# EasyEDA Pro project ProPrj_Sandro OrangePi CM5 Carrier Board_2024-09-12.epro, board PCB
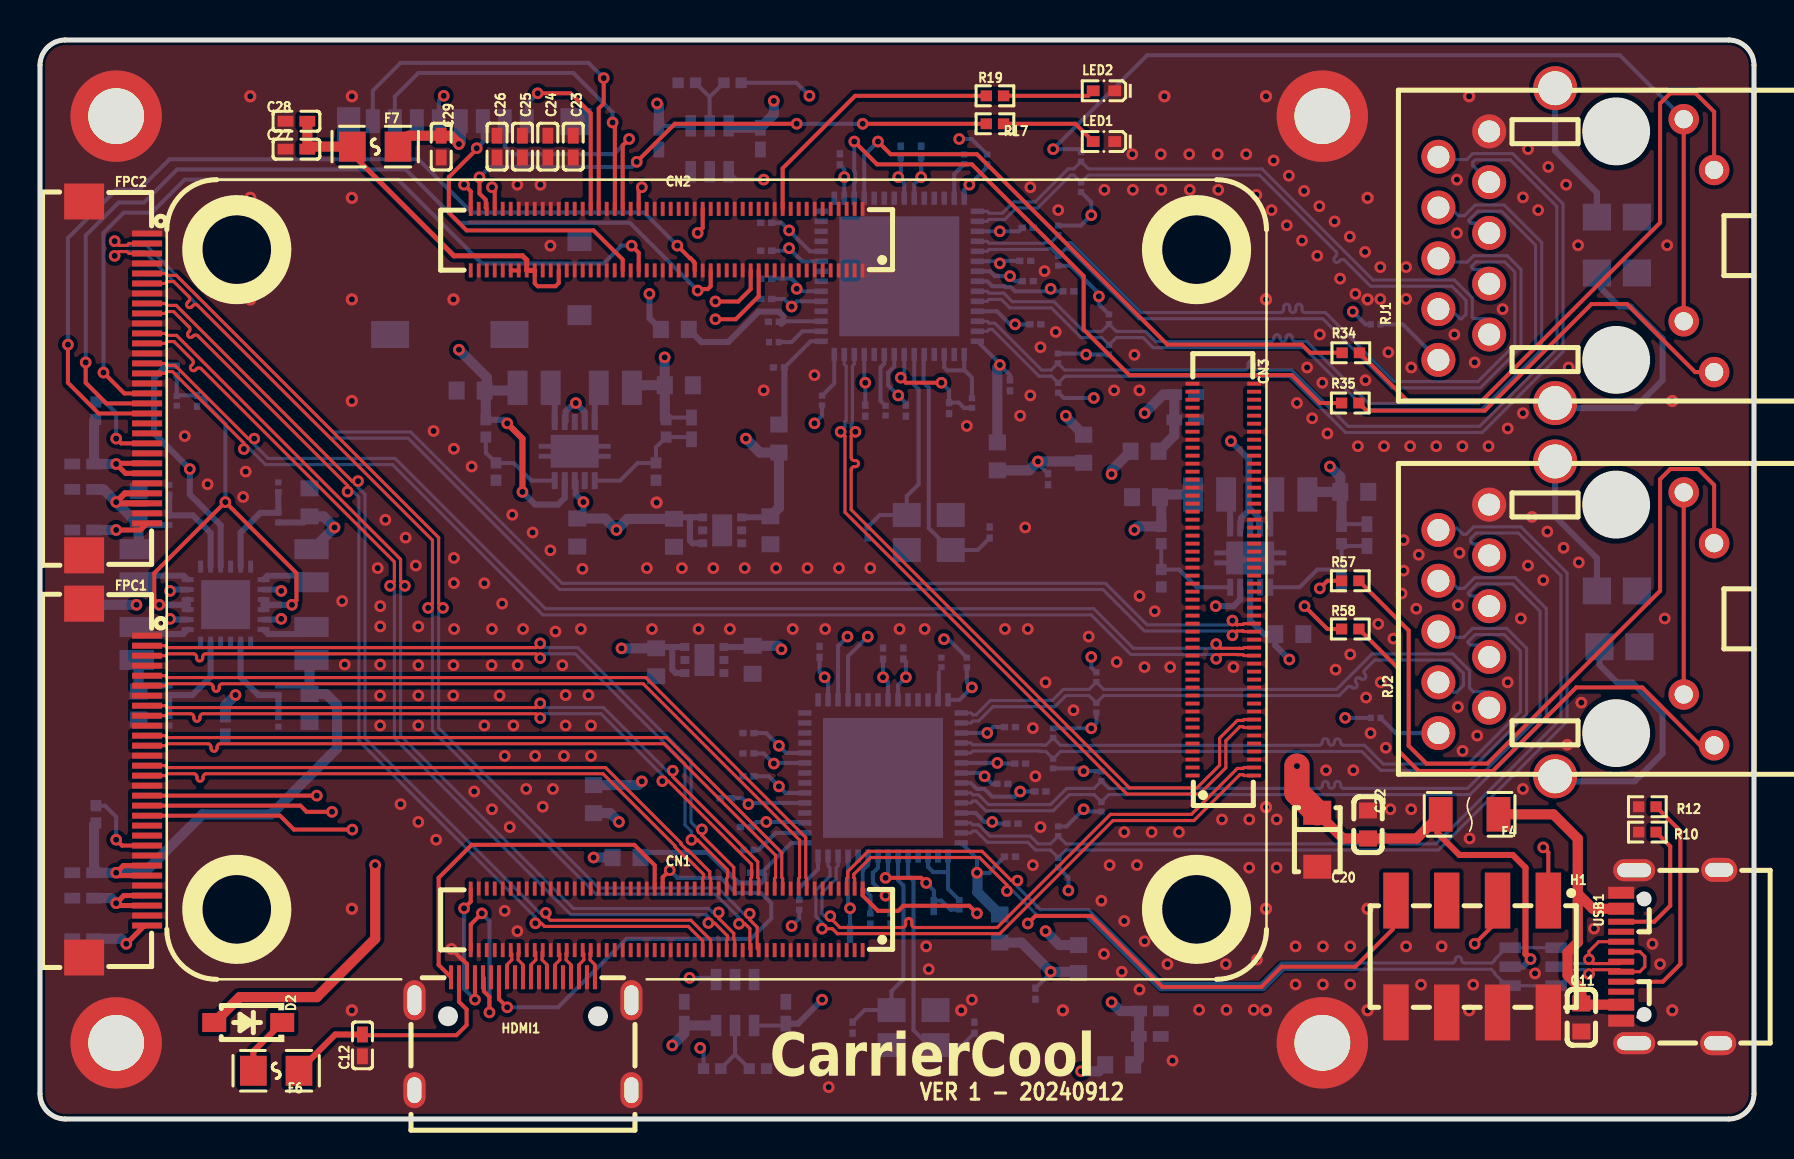
[diagram p2: board, top side]
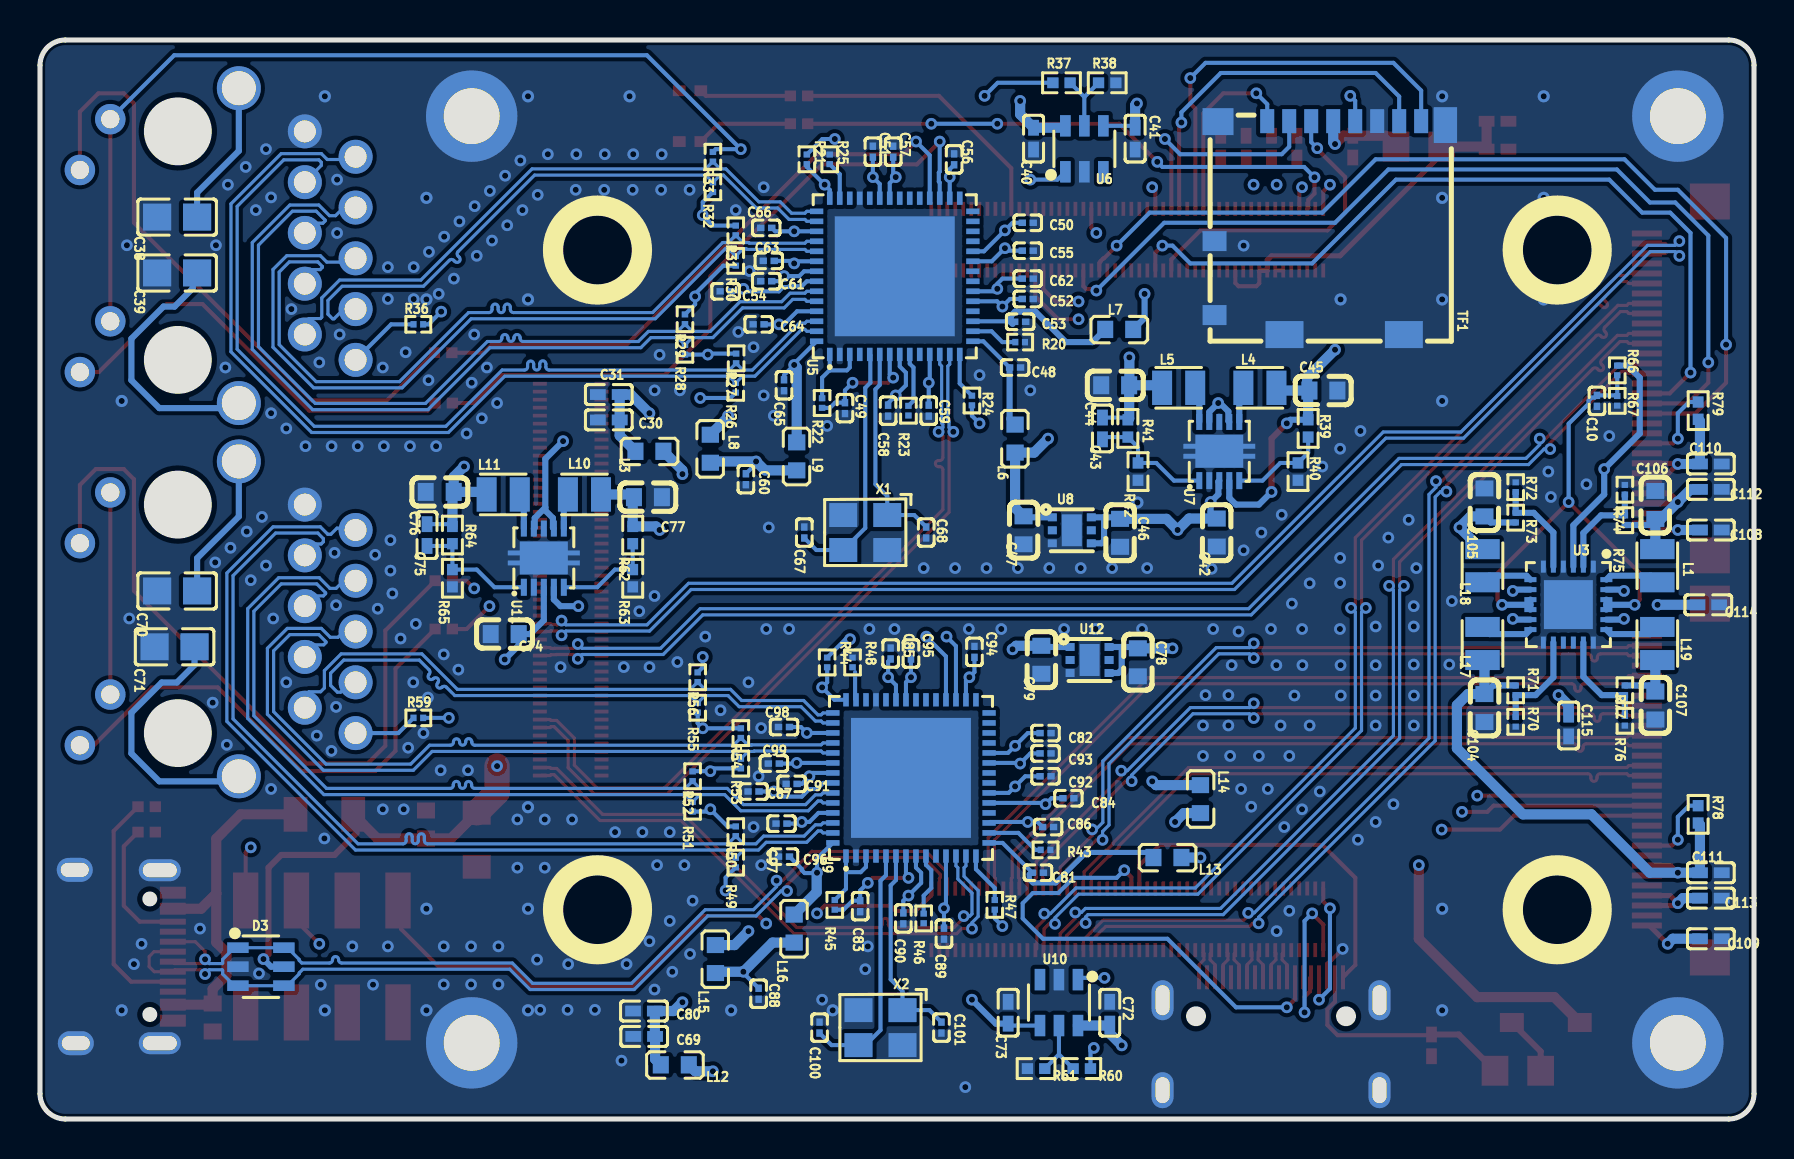
[diagram p3: board, bottom side, seen from below]

Outline 85.72 x 53.97 mm; copper layers: Top Layer, Inner1, Inner2, Bottom Layer. Coordinates in mm from the lower left corner of the outline.
Outline path: 0,52.7 0,1.27 arc(0.37,0.37) 1.27,0 84.46,0 arc(85.35,0.37) 85.72,1.27 85.72,52.7 arc(85.35,53.6) 84.46,53.97 1.27,53.97 arc(0.37,53.6) 0,52.7
Stack: Top Layer 0.035mm Outer layer copper thickness 1oz / Dielectric1 0.2104mm 7628 RC49% 8.6mil / Inner1 0.0152mm Inner layer copper thickness / Dielectric2 1.065mm 1.1mm H/HOZ Copper / Inner2 0.0152mm Inner layer copper thickness / Dielectric3 0.2104mm 7628 RC49% 8.6mil / Bottom Layer 0.035mm Outer layer copper thickness 1oz

## Design rules (mm)
net USB_N: DP1
net USB_P: DP1
net HDMI0_TX2_P: DP2
net HDMI0_TX1_P: DP3
net HDMI0_TX1_N: DP3
net HDMI0_TX0_P: DP4
net HDMI0_TX0_N: DP4
net HDMI0_CLK_P: DP5
net HDMI0_CLK_N: DP5
net HDMI0_TX2_N: DP2
net CSI0_D0N: DP16
net CSI0_D0P: DP16
net CSI0_D1N: DP14
net CSI0_D1P: DP14
net CSI0_CKN: DP15
net CSI0_CKP: DP15
net CSI0_D2N: DP20
net CSI0_D2P: DP20
net CSI0_D3N: DP13
net CSI0_D3P: DP13
net CSI1_CKP: DP19
net CSI1_CKN: DP19
net CSI1_D1P: DP18
net CSI1_D1N: DP18
net CSI1_D0P: DP17
net CSI1_D0N: DP17
net CSI1_D3N: DP21
net CSI1_D3P: DP21
net ETH0_TR3_P: DP6
net ETH0_TR3_N: DP6
net ETH0_TR2_P: DP8
net ETH0_TR2_N: DP8
net ETH0_TR1_P: DP7
net ETH0_TR1_N: DP7
net ETH0_TR0_P: DP9
net ETH0_TR0_N: DP9
net ETH1_TR3_P: ETH1_TR3
net ETH1_TR3_N: ETH1_TR3
net ETH1_TR2_P: DP12
net ETH1_TR2_N: DP12
net ETH1_TR1_P: DP11
net ETH1_TR1_N: DP11
net ETH1_TR0_P: DP10
net ETH1_TR0_N: DP10
net ETH0_USB_M: DP24
net ETH0_USB_P: DP24
net ETH1_USB_M: DP23
net ETH1_USB_P: DP23
net CSI1_D2P: DP22
net CSI1_D2N: DP22
template: Custom Config
spacing copperThickness1oz (default): track to track 0.102, other pairs 0.076 to 0.3
spacing copperThickness2oz: track to track 0.203, other pairs 0.152 to 0.3
spacing copperThicknessInner0.5oz: track to track 0.089, other pairs 0.152 to 0.3
track width copperThickness1oz (default): min 0.102, default 0.254, max 2.54
track width copperThickness0.5oz: min 0.089, default 0.254, max 2.54
track width copperThickness2oz: min 0.203, default 0.254, max 2.54
differential pair differentialPair (default): width min 0.127, default 0.157, max 0.157; gap min 0.152, default 0.152
via viaSize (default): diameter min 0.3, default 0.61, max 10; hole min 0.201, default 0.305, max 6.299

## Placement (name value [footprint] x y rotation side)
C10  100nF  [C0201]  7.86 35.92 270 bottom
C11  2.2uF  [C0603]  77.09 5.08 270 top
C12  100nF  [C0402]  16.13 3.68 270 top
C20  22uF  [CAP-SMD_L3.2-W1.6]  63.88 13.97 270 top
C22  100nF  [C0603]  66.42 14.73 90 top
C23  100nF  [C0402]  26.67 48.64 90 top
C24  100nF  [C0402]  25.4 48.64 90 top
C25  100nF  [C0402]  24.13 48.64 90 top
C26  100nF  [C0402]  22.86 48.64 90 top
C27  100nF  [C0402]  12.83 48.51 180 top
C28  100nF  [C0402]  12.83 49.91 180 top
C29  100nF  [C0402]  20.07 48.64 270 top
C30  100nF  [C0402]  57.28 34.97 180 bottom
C31  10nF  [C0402]  57.28 36.24 180 bottom
C38  100nF  [C0805]  78.87 45.11 0 bottom
C39  100nF  [C0805]  78.87 42.32 180 bottom
C40  100nF  [C0402]  36.03 49.04 270 bottom
C41  100nF  [C0402]  30.95 49.04 270 bottom
C42  4.7uF  [C0603]  26.87 29.34 90 bottom
C43  22pF  [C0402]  32.59 34.54 270 bottom
C44  10uF  [C0603]  31.95 36.7 0 bottom
C45  10uF  [C0603]  21.54 36.44 180 bottom
C46  2.2uF  [C0603]  31.71 29.32 270 bottom
C47  2.2uF  [C0603]  36.53 29.45 270 bottom
C48  100nF  [C0201]  36.96 37.59 0 bottom
C49  100nF  [C0201]  45.47 35.56 90 bottom
C50  100nF  [C0201]  36.32 44.83 0 bottom
C51  100nF  [C0201]  44.07 48.39 270 bottom
C52  100nF  [C0201]  36.32 41.02 0 bottom
C53  100nF  [C0201]  36.7 39.88 0 bottom
C54  100nF  [C0201]  51.44 41.4 180 bottom
C55  100nF  [C0201]  36.32 43.43 0 bottom
C56  100nF  [C0201]  40 48.01 270 bottom
C57  100nF  [C0201]  43.05 48.39 270 bottom
C58  100nF  [C0201]  43.31 35.43 90 bottom
C59  100nF  [C0201]  41.28 35.43 90 bottom
C60  100nF  [C0201]  50.42 32 90 bottom
C61  100nF  [C0201]  49.4 41.91 180 bottom
C62  100nF  [C0201]  36.32 42.04 0 bottom
C63  100nF  [C0201]  49.28 42.93 180 bottom
C64  100nF  [C0201]  49.78 39.75 180 bottom
C65  100nF  [C0201]  48.51 36.7 90 bottom
C66  100nF  [C0201]  49.4 44.58 180 bottom
C67  100nF  [C0201]  47.5 29.34 90 bottom
C68  100nF  [C0201]  41.4 29.34 90 bottom
C69  10nF  [C0402]  55.51 4.13 180 bottom
C70  100nF  [C0805]  78.87 26.42 0 bottom
C71  100nF  [C0805]  78.99 23.62 180 bottom
C72  100nF  [C0402]  32.22 5.32 90 bottom
C73  100nF  [C0402]  37.3 5.32 90 bottom
C74  4.7uF  [C0603]  62.48 24.26 180 bottom
C75  22pF  [C0402]  66.37 29.21 270 bottom
C76  10uF  [C0603]  65.73 31.37 0 bottom
C77  10uF  [C0603]  55.32 31.11 180 bottom
C78  2.2uF  [C0603]  30.82 22.84 270 bottom
C79  2.2uF  [C0603]  35.64 22.97 270 bottom
C80  100nF  [C0402]  55.52 5.4 180 bottom
C81  100nF  [C0201]  35.81 12.32 0 bottom
C82  100nF  [C0201]  35.43 19.3 0 bottom
C83  100nF  [C0201]  44.7 10.65 90 bottom
C84  100nF  [C0201]  34.29 16.05 0 bottom
C85  100nF  [C0201]  43.18 23.28 270 bottom
C86  100nF  [C0201]  35.31 14.61 0 bottom
C87  100nF  [C0201]  50.04 16.38 180 bottom
C88  100nF  [C0201]  49.78 6.27 90 bottom
C89  100nF  [C0201]  40.51 9.27 90 bottom
C90  100nF  [C0201]  42.54 10.03 90 bottom
C91  100nF  [C0201]  48.13 16.76 180 bottom
C92  100nF  [C0201]  35.43 17.14 0 bottom
C93  100nF  [C0201]  35.43 18.29 0 bottom
C94  100nF  [C0201]  38.99 23.37 270 bottom
C95  100nF  [C0201]  42.16 23.28 270 bottom
C96  100nF  [C0201]  48.51 13.12 180 bottom
C97  100nF  [C0201]  48.64 14.78 180 bottom
C98  100nF  [C0201]  48.51 19.61 180 bottom
C99  100nF  [C0201]  49.02 17.78 180 bottom
C100  100nF  [C0201]  46.74 4.57 90 bottom
C101  100nF  [C0201]  40.64 4.57 90 bottom
C104  22uF  [C0603]  13.48 20.56 270 bottom
C105  22uF  [C0603]  13.48 30.84 90 bottom
C106  22uF  [C0603]  4.94 30.72 90 bottom
C107  22uF  [C0603]  4.94 20.68 270 bottom
C108  100nF  [C0402]  2.16 29.46 180 bottom
C109  100nF  [C0402]  2.16 9.02 180 bottom
C110  100nF  [C0402]  2.16 32.77 180 bottom
C111  100nF  [C0402]  2.16 12.32 180 bottom
C112  100nF  [C0402]  2.16 31.5 180 bottom
C113  100nF  [C0402]  2.16 11.05 180 bottom
C114  2.2uF  [C0402]  2.29 25.72 180 bottom
C115  2.2uF  [C0402]  9.27 19.69 270 bottom
CN1  DF40HC(3.0)-100DS-0.4V(51)  [CONN-SMD_DF40HC-3.0-100DS-0.4V-51]  31.34 9.99 0 top
CN2  DF40HC(3.0)-100DS-0.4V(51)  [CONN-SMD_DF40HC-3.0-100DS-0.4V-51]  31.34 43.99 0 top
CN3  DF40HC(3.0)-100DS-0.4V(51)  [CONN-SMD_DF40HC-3.0-100DS-0.4V-51]  59.18 26.98 270 top
D2  B5819W  [SOD-123_L2.7-W1.6-LS3.7-RD-1]  10.41 4.83 180 top
D3  USBLC6-2SC6  [SOT-23-6_L2.9-W1.6-P0.95-LS2.8-BL]  74.68 7.62 270 bottom
F4  BSMD1206L-300  [F1206]  71.5 15.24 0 top
F6  BSMD0805-050-24V  [F0805]  11.81 2.41 0 top
F7  BSMD0805-050-24V  [F0805]  16.76 48.64 0 top
FPC1  AFC24-S30FIC-00  [FPC-SMD_P0.50-30P_QCHF-SM-H2.0]  3.78 16.93 90 top
FPC2  AFC24-S30FIC-00  [FPC-SMD_P0.50-30P_QCHF-SM-H2.0]  3.78 37.05 90 top
H1  2.54-2*4P立贴针  [HDR-SMD_8P-P2.54-V-M-R2-C4-LS7.4]  71.63 8.13 180 top
HDMI1  A71-05H4-111N1  [HDMI-SMD_A71-05H4-111N1]  24.16 4.27 0 top
L1  2.2uH  [IND-SMD_L2.0-W1.6]  4.84 27.68 90 bottom
L3  BLM18SG121TZ1D  [L0603]  55.25 33.4 0 bottom
L4  2.2uH  [IND-SMD_L2.0-W1.6]  24.71 36.58 0 bottom
L5  2.2uH  [IND-SMD_L2.0-W1.6]  28.78 36.58 180 bottom
L6  BLM18SG121TZ1D  [L0603]  36.96 34.04 90 bottom
L7  BLM18SG121TZ1D  [L0603]  31.75 39.5 0 bottom
L8  BLM18SG121TZ1D  [L0603]  52.2 33.53 90 bottom
L9  BLM18SG121TZ1D  [L0603]  47.88 33.15 90 bottom
L10  2.2uH  [IND-SMD_L2.0-W1.6]  58.49 31.24 0 bottom
L11  2.2uH  [IND-SMD_L2.0-W1.6]  62.56 31.24 180 bottom
L12  BLM18SG121TZ1D  [L0603]  53.97 2.71 0 bottom
L13  BLM18SG121TZ1D  [L0603]  29.34 13.08 0 bottom
L14  BLM18SG121TZ1D  [L0603]  27.69 16 270 bottom
L15  BLM18SG121TZ1D  [L0603]  51.94 8 90 bottom
L16  BLM18SG121TZ1D  [L0603]  48.01 9.53 90 bottom
L17  2.2uH  [IND-SMD_L2.0-W1.6]  13.58 23.79 270 bottom
L18  2.2uH  [IND-SMD_L2.0-W1.6]  13.58 27.68 90 bottom
L19  2.2uH  [IND-SMD_L2.0-W1.6]  4.84 23.79 270 bottom
LED1  XL-1005UGC  [LED0402-RD_GREEN]  53.21 48.89 180 top
LED2  XL-1005UOC  [LED0402-RD_ORANGE]  53.21 51.44 180 top
NOREF  -  [Pad_e33]  3.81 50.17 270 top
NOREF#2  -  [Pad_e35]  64.13 50.17 180 top
NOREF#3  -  [Pad_e32]  3.81 3.81 0 top
NOREF#4  -  [Pad_e37]  64.13 3.81 90 top
R10  6.1K  [R0402]  80.39 14.35 180 top
R12  6.1K  [R0402]  80.39 15.62 0 top
R17  1K  [R0402]  47.76 49.78 180 top
R19  1K  [R0402]  47.76 51.18 180 top
R20  10K  [R0201]  36.7 38.86 0 bottom
R21  10K  [R0201]  47.37 48.01 90 bottom
R22  10K  [R0201]  46.61 35.81 90 bottom
R23  10K  [R0201]  42.29 35.43 90 bottom
R24  10K  [R0201]  39.12 35.94 90 bottom
R25  10K  [R0201]  46.23 48.01 270 bottom
R26  10K  [R0201]  50.93 36.58 270 bottom
R27  10K  [R0201]  50.91 38.05 90 bottom
R28  10K  [R0201]  53.47 38.48 270 bottom
R29  10K  [R0201]  53.47 40 90 bottom
R30  10K  [R0201]  50.93 42.93 270 bottom
R31  10K  [R0201]  50.93 44.45 90 bottom
R32  10K  [R0201]  52.07 46.61 270 bottom
R33  10K  [R0201]  52.07 48.13 90 bottom
R34  330  [R0402]  65.56 38.33 0 top
R35  330  [R0402]  65.53 35.81 0 top
R36  10K  [R0201]  66.8 39.75 180 bottom
R37  49.9K  [R0402]  34.64 51.83 0 bottom
R38  20K  [R0402]  32.35 51.83 0 bottom
R39  360K  [R0402]  22.3 34.54 90 bottom
R40  348K  [R0402]  22.81 32.39 90 bottom
R41  360K  [R0402]  31.32 34.54 90 bottom
R42  115K  [R0402]  30.81 32.39 90 bottom
R43  10K  [R0201]  35.43 13.46 0 bottom
R44  10K  [R0201]  46.35 22.84 90 bottom
R45  10K  [R0201]  45.97 10.71 90 bottom
R46  10K  [R0201]  41.53 10.03 90 bottom
R47  10K  [R0201]  37.97 10.71 90 bottom
R48  10K  [R0201]  45.09 22.84 270 bottom
R49  10K  [R0201]  50.93 12.83 270 bottom
R50  10K  [R0201]  50.93 14.39 90 bottom
R51  10K  [R0201]  53.09 15.62 270 bottom
R52  10K  [R0201]  53.09 17.14 90 bottom
R53  10K  [R0201]  50.67 17.78 270 bottom
R54  10K  [R0201]  50.67 19.3 90 bottom
R55  10K  [R0201]  52.83 20.57 270 bottom
R56  10K  [R0201]  52.83 22.1 90 bottom
R57  330  [R0402]  65.53 26.92 0 top
R58  330  [R0402]  65.53 24.51 0 top
R59  10K  [R0201]  66.8 20.07 180 bottom
R60  49.9K  [R0402]  33.62 2.52 180 bottom
R61  20K  [R0402]  35.91 2.52 180 bottom
R62  360K  [R0402]  56.08 29.21 90 bottom
R63  348K  [R0402]  56.08 27.05 90 bottom
R64  360K  [R0402]  65.1 29.21 90 bottom
R65  115K  [R0402]  65.1 27.05 90 bottom
R66  10K  [R0201]  6.84 37.45 270 bottom
R67  100K  [R0201]  6.84 35.92 270 bottom
R70  150K  [R0201]  11.92 19.87 270 bottom
R71  412K  [R0201]  11.92 21.45 270 bottom
R72  150K  [R0201]  11.92 31.61 90 bottom
R73  300K  [R0201]  11.92 30.08 90 bottom
R74  150K  [R0201]  6.46 31.48 90 bottom
R75  150K  [R0201]  6.46 29.95 90 bottom
R76  150K  [R0201]  6.46 19.92 270 bottom
R77  75K  [R0201]  6.46 21.45 270 bottom
R78  10K  [R0402]  2.79 15.24 270 bottom
R79  10K  [R0402]  2.79 35.43 270 bottom
RJ1  RB1-125B8G1A  [RJ45-TH_RB1-125B8G1A]  76.84 43.69 90 top
RJ2  RB1-125B8G1A  [RJ45-TH_RB1-125B8G1A]  76.84 25.02 90 top
TF1  1040310811  [SIM-SMD_8P-1040310811]  21.21 44.58 0 bottom
U3  EA3059  [VQFN-24_L4.0-W4.0-P0.50-TL-EP2.5]  9.28 25.73 270 bottom
U5  LAN7500I-ABZJ  [QFN-56_L8.0-W8.0-P0.50-BL-EP6.0]  42.98 42.15 180 bottom
U6  STM6719SFWB6F  [SOT-23-6_L2.9-W1.6-P0.95-LS2.9-BL]  33.49 48.53 180 bottom
U7  TPS62410DRCR  [VSON-10_L3.0-W3.0-P0.50-BL-EP1.65]  26.74 33.4 180 bottom
U8  LP5900SD-3.3/NOPB  [WSON-6_L2.0-W2.0-P0.65-BL-EP]  34.12 29.45 270 bottom
U9  LAN7500I-ABZJ  [QFN-56_L8.0-W8.0-P0.50-BL-EP6.0]  42.16 17.06 180 bottom
U10  STM6719SFWB6F  [SOT-23-6_L2.9-W1.6-P0.95-LS2.9-BL]  34.76 5.82 0 bottom
U11  TPS62410DRCR  [VSON-10_L3.0-W3.0-P0.50-BL-EP1.65]  60.53 28.07 180 bottom
U12  LP5900SD-3.3/NOPB  [WSON-6_L2.0-W2.0-P0.65-BL-EP]  33.23 22.96 270 bottom
USB1  918-418K2023S40001  [USB-C-SMD_TYPE-C-USB-17]  81.53 8.13 90 top
X1  25MHz  [OSC-SMD_4P-L3.2-W2.5-BL]  44.45 29.34 0 bottom
X2  25MHz  [OSC-SMD_4P-L3.2-W2.5-BL]  43.69 4.57 0 bottom

## Footprints (pads in the part's own frame, mm; a bottom-side part is the same pattern mirrored in y, then rotated)
C0201
  rect 0.368x0.324 smd: 1(-0.275,0) 2(0.275,0)
C0402
  rect 0.79x0.54 smd: 1(-0.545,0) 2(0.545,0)
C0603
  rect 0.8x0.9 smd: 1(-0.7,0) 2(0.7,0)
C0805
  rect 1.41x1.35 smd: 1(-1,0) 2(1,0)
CAP-SMD_L3.2-W1.6
  rect 1.2x1.4 smd: 1(-1.35,0) 2(1.35,0)
CONN-SMD_DF40HC-3.0-100DS-0.4V-51
  rect 0.19x0.7 smd: 1(9.8,-1.54) 2(9.4,-1.54) 3(9,-1.54) 4(8.6,-1.54) 5(8.2,-1.54) 6(7.8,-1.54) 7(7.4,-1.54) 8(7,-1.54) 9(6.6,-1.54) 10(6.2,-1.54) 11(5.8,-1.54) 12(5.4,-1.54) 13(5,-1.54) 14(4.6,-1.54) 15(4.2,-1.54) 16(3.8,-1.54) 17(3.4,-1.54) 18(3,-1.54) 19(2.6,-1.54) 20(2.2,-1.54) 21(1.8,-1.54) 22(1.4,-1.54) 23(1,-1.54) 24(0.6,-1.54) 25(0.2,-1.54) 26(-0.2,-1.54) 27(-0.6,-1.54) 28(-1,-1.54) 29(-1.4,-1.54) 30(-1.8,-1.54) 31(-2.2,-1.54) 32(-2.6,-1.54) 33(-3,-1.54) 34(-3.4,-1.54) 35(-3.8,-1.54) 36(-4.2,-1.54) 37(-4.6,-1.54) 38(-5,-1.54) 39(-5.4,-1.54) 40(-5.8,-1.54) 41(-6.2,-1.54) 42(-6.6,-1.54) 43(-7,-1.54) 44(-7.4,-1.54) 45(-7.8,-1.54) 46(-8.2,-1.54) 47(-8.6,-1.54) 48(-9,-1.54) 49(-9.4,-1.54) 50(-9.8,-1.54) 51(-9.8,1.54) 52(-9.4,1.54) 53(-9,1.54) 54(-8.6,1.54) 55(-8.2,1.54) 56(-7.8,1.54) 57(-7.4,1.54) 58(-7,1.54) 59(-6.6,1.54) 60(-6.2,1.54) 61(-5.8,1.54) 62(-5.4,1.54) 63(-5,1.54) 64(-4.6,1.54) 65(-4.2,1.54) 66(-3.8,1.54) 67(-3.4,1.54) 68(-3,1.54) 69(-2.6,1.54) 70(-2.2,1.54) 71(-1.8,1.54) 72(-1.4,1.54) 73(-1,1.54) 74(-0.6,1.54) 75(-0.2,1.54) 76(0.2,1.54) 77(0.6,1.54) 78(1,1.54) 79(1.4,1.54) 80(1.8,1.54) 81(2.2,1.54) 82(2.6,1.54) 83(3,1.54) 84(3.4,1.54) 85(3.8,1.54) 86(4.2,1.54) 87(4.6,1.54) 88(5,1.54) 89(5.4,1.54) 90(5.8,1.54) 91(6.2,1.54) 92(6.6,1.54) 93(7,1.54) 94(7.4,1.54) 95(7.8,1.54) 96(8.2,1.54) 97(8.6,1.54) 98(9,1.54) 99(9.4,1.54) 100(9.8,1.54)
F0805
  rect 1.335x1.5 smd: 1(-1.143,0) 2(1.143,0)
F1206
  rect 1.19x1.728 smd: 1(-1.445,0) 2(1.445,0)
FPC-SMD_P0.50-30P_QCHF-SM-H2.0
  rect 0.3x1.5 smd: 1(7.25,-1.573) 2(6.748,-1.573) 3(6.248,-1.573) 4(5.748,-1.573) 5(5.248,-1.573) 6(4.748,-1.573) 7(4.248,-1.573) 8(3.748,-1.573) 9(3.248,-1.573) 10(2.748,-1.573) 11(2.248,-1.573) 12(1.748,-1.573) 13(1.248,-1.573) 14(0.748,-1.573) 15(0.248,-1.573) 16(-0.252,-1.573) 17(-0.752,-1.573) 18(-1.252,-1.573) 19(-1.754,-1.572) 20(-2.252,-1.573) 21(-2.75,-1.575) 22(-3.25,-1.575) 23(-3.75,-1.575) 24(-4.25,-1.575) 25(-4.75,-1.575) 26(-5.25,-1.575) 27(-5.75,-1.575) 28(-6.25,-1.575) 29(-6.75,-1.575) 30(-7.25,-1.575)
  rect 1.8x2 smd: 31(8.85,1.575) 32(-8.85,1.575)
HDMI-SMD_A71-05H4-111N1
  rect 0.2x1.2 smd: 1(3.6,2.825) 2(3.2,2.825) 3(2.8,2.825) 4(2.4,2.825) 5(2,2.825) 6(1.6,2.825) 7(1.2,2.825) 8(0.8,2.825) 9(0.4,2.825) 10(0,2.825) 11(-0.4,2.825) 12(-0.8,2.825) 13(-1.2,2.825) 14(-1.6,2.825) 15(-2,2.825) 16(-2.4,2.825) 17(-2.8,2.825) 18(-3.2,2.825) 19(-3.6,2.825)
  oval 1.1x2 hole 0.7x1.5: 20(-5.425,1.675) 21(5.425,1.675)
  oval 1.1x1.8 hole 0.7x1.3: 22(-5.425,-2.825) 23(5.425,-2.825)
HDR-SMD_8P-P2.54-V-M-R2-C4-LS7.4
  rect 1.27x2.8 smd: 1(-3.81,-2.8) 2(-3.81,2.8) 3(-1.27,-2.8) 4(-1.27,2.8) 5(1.27,-2.8) 6(1.27,2.8) 7(3.81,-2.8) 8(3.81,2.794)
IND-SMD_L2.0-W1.6
  rect 1x1.72 smd: 1(0.828,0) 2(-0.828,0)
L0603
  rect 0.8x0.864 smd: 1(-0.7,0) 2(0.7,0)
LED0402-RD_GREEN
  rect 0.636x0.54 smd: 1(-0.538,0) 2(0.538,0)
LED0402-RD_ORANGE
  rect 0.636x0.54 smd: 1(-0.538,0) 2(0.538,0)
OSC-SMD_4P-L3.2-W2.5-BL
  rect 1.4x1.2 smd: 1(-1.1,-0.875) 2(1.1,-0.875) 3(1.1,0.875) 4(-1.1,0.875)
Pad_e32
  round 4.572 hole 2.794: 1(0,0)
Pad_e33
  round 4.572 hole 2.794: 1(0,0)
Pad_e35
  round 4.572 hole 2.794: 1(0,0)
Pad_e37
  round 4.572 hole 2.794: 1(0,0)
QFN-56_L8.0-W8.0-P0.50-BL-EP6.0
  rect 0.28x0.665 smd: 1(-3.25,-3.908) 2(-2.75,-3.908) 3(-2.25,-3.908) 4(-1.75,-3.908) 5(-1.25,-3.908) 6(-0.75,-3.908) 7(-0.25,-3.908) 8(0.25,-3.908) 9(0.75,-3.908) 10(1.25,-3.908) 11(1.75,-3.908) 12(2.25,-3.908) 13(2.75,-3.908) 14(3.25,-3.908) 29(3.25,3.908) 30(2.75,3.908) 31(2.25,3.908) 32(1.75,3.908) 33(1.25,3.908) 34(0.75,3.908) 35(0.25,3.908) 36(-0.25,3.908) 37(-0.75,3.908) 38(-1.25,3.908) 39(-1.75,3.908) 40(-2.25,3.908) 41(-2.75,3.908) 42(-3.25,3.908)
  rect 0.665x0.28 smd: 15(3.908,-3.25) 16(3.908,-2.75) 17(3.908,-2.25) 18(3.908,-1.75) 19(3.908,-1.25) 20(3.908,-0.75) 21(3.908,-0.25) 22(3.908,0.25) 23(3.908,0.75) 24(3.908,1.25) 25(3.908,1.75) 26(3.908,2.25) 27(3.908,2.75) 28(3.908,3.25) 43(-3.908,3.25) 44(-3.908,2.75) 45(-3.908,2.25) 46(-3.908,1.75) 47(-3.908,1.25) 48(-3.908,0.75) 49(-3.908,0.25) 50(-3.908,-0.25) 51(-3.908,-0.75) 52(-3.908,-1.25) 53(-3.908,-1.75) 54(-3.908,-2.25) 55(-3.908,-2.75) 56(-3.908,-3.25)
  rect 6x6 smd: 57(0,0)
R0201
  rect 0.303x0.324 smd: 1(-0.241,0) 2(0.241,0)
R0402
  rect 0.566x0.54 smd: 1(-0.433,0) 2(0.433,0)
RJ45-TH_RB1-125B8G1A
  round 2.2 hole 1.7: 15(7.875,1.055) 16(-7.875,1.055)
  round 1.524 hole 0.914: L1(6.325,-5.375) L2(3.785,-6.895) L3(-3.785,-5.375) L4(-6.325,-6.895)
  round 1.7 hole 1.1: R1(-5.715,6.895) R2(-4.445,4.355) R3(-3.175,6.895) R4(-1.905,4.355) R5(-0.635,6.895) R6(0.635,4.355) R7(1.905,6.895) R8(3.175,4.355) R9(4.445,6.895) R10(5.715,4.355)
SIM-SMD_8P-1040310811
  rect 0.7x1.2 smd: 1(3.138,-5.338) 2(2.038,-5.338) 3(0.938,-5.338) 4(-0.163,-5.338) 5(-1.262,-5.338) 6(-2.362,-5.338) 7(-3.462,-5.338) 8(-4.562,-5.338)
  rect 1.17x1.8 smd: 9(-5.772,-5.138)
  rect 1.55x1.35 smd: 10(5.598,-5.312)
  rect 1.2x1 smd: 11(5.772,0.662) 12(5.772,4.362)
  rect 1.9x1.35 smd: 13(2.272,5.338) 14(-3.697,5.338)
SOD-123_L2.7-W1.6-LS3.7-RD-1
  rect 1.2x0.95 smd: 1(-1.7,0) 2(1.7,0)
SOT-23-6_L2.9-W1.6-P0.95-LS2.8-BL
  rect 0.532x1.072 smd: 1(-0.95,-1.149) 2(0,-1.149) 3(0.95,-1.149) 4(0.95,1.149) 5(0,1.149) 6(-0.95,1.149)
SOT-23-6_L2.9-W1.6-P0.95-LS2.9-BL
  rect 0.532x1.072 smd: 1(-0.95,-1.149) 2(0,-1.149) 3(0.95,-1.149) 4(0.95,1.149) 5(0,1.149) 6(-0.95,1.149)
USB-C-SMD_TYPE-C-USB-17
  oval 1.1x2.1 hole 0.7x1.7: 0(-4.334,1.802) 0(4.316,1.802)
  oval 1.2x1.8 hole 0.7x1.4: 0(-4.334,-2.398) 0(4.334,-2.453)
  rect 0.6x1.3 smd: A1(-3.209,2.451) A4(-2.409,2.451) A9(2.391,2.452) A12(3.191,2.451)
  rect 0.3x1.3 smd: A5(-1.259,2.451) A6(-0.259,2.451) A7(0.241,2.451) A8(1.24,2.453) B5(1.741,2.451) B6(0.741,2.451) B7(-0.759,2.451) B8(-1.759,2.453)
VQFN-24_L4.0-W4.0-P0.50-TL-EP2.5
  rect 0.6x0.25 smd: 1(-1.9,1.25) 2(-1.9,0.75) 3(-1.9,0.25) 4(-1.9,-0.25) 5(-1.9,-0.75) 6(-1.9,-1.25) 13(1.9,-1.25) 14(1.9,-0.75) 15(1.9,-0.25) 16(1.9,0.25) 17(1.9,0.75) 18(1.9,1.25)
  rect 0.25x0.6 smd: 7(-1.25,-1.9) 8(-0.75,-1.9) 9(-0.25,-1.9) 10(0.249,-1.9) 11(0.75,-1.9) 12(1.25,-1.9) 19(1.25,1.9) 20(0.75,1.9) 21(0.249,1.9) 22(-0.25,1.9) 23(-0.75,1.9) 24(-1.25,1.9)
  rect 2.45x2.45 smd: 25(0,0)
VSON-10_L3.0-W3.0-P0.50-BL-EP1.65
  rect 0.3x0.85 smd: 1(-1,-1.468) 2(-0.5,-1.468) 3(0,-1.468) 4(0.5,-1.468) 5(1,-1.468)
  rect 0.3x0.8 smd: 6(1,1.468) 7(0.5,1.468) 8(0,1.468) 9(-0.5,1.468) 10(-1,1.468)
  custom 3.6x1.65 smd: 11(0,0)
WSON-6_L2.0-W2.0-P0.65-BL-EP
  rect 0.4x0.45 smd: 1(-0.65,-0.975) 2(0,-0.975) 3(0.65,-0.975) 4(0.65,0.975) 5(0,0.975) 6(-0.65,0.975)
  rect 1.6x1 smd: 7(0,0)

## Nets
As in the schematic, except:
GND: C10.2 C11.2 C12.2 C20.2 C22.2 C23.2 C24.2 C25.2 C26.2 C27.2 C28.2 C29.2 C30.1 C31.1 C38.2 C39.1 C40.2 C41.2 C42.1 C44.2 C45.2 C46.2 C47.2 C48.1 C49.1 C50.1 C51.1 C52.1 C53.1 C54.1 C55.1 C56.1 C57.1 C58.1 C59.1 C60.1 C61.1 C62.1 C63.1 C64.1 C65.1 C66.1 C67.2 C68.1 C69.1 C70.2 C71.1 C72.2 C73.2 C74.1 C76.2 C77.2 C78.2 C79.2 C80.1 C81.1 C82.1 C83.1 C84.1 C85.1 C86.1 C87.1 C88.1 C89.1 C90.1 C91.1 C92.1 C93.1 C94.1 C95.1 C96.1 C97.1 C98.1 C99.1 C100.2 C101.1 C104.2 C105.2 C106.2 C107.2 C108.2 C109.2 C110.2 C111.2 C112.2 C113.2 C114.2 C115.2 CN1.4 CN1.7 CN1.10 CN1.13 CN1.16 CN1.19 CN1.22 CN1.25 CN1.28 CN1.31 CN1.34 CN1.37 CN1.40 CN1.43 CN1.46 CN1.49 CN1.52 CN1.55 CN1.58 CN1.61 CN1.64 CN1.67 CN1.70 CN1.73 CN1.82 CN1.85 CN1.88 CN1.91 CN1.94 CN1.97 CN2.1 CN2.4 CN2.7 CN2.11 CN2.16 CN2.21 CN2.26 CN2.30 CN2.33 CN2.37 CN2.49 CN2.65 CN2.68 CN2.71 CN2.74 CN2.79 CN2.84 CN2.89 CN2.94 CN2.97 CN2.100 CN3.3 CN3.6 CN3.9 CN3.16 CN3.22 CN3.27 CN3.32 CN3.37 CN3.40 CN3.43 CN3.46 CN3.50 CN3.51 CN3.57 CN3.63 CN3.68 CN3.73 CN3.78 CN3.80 CN3.83 CN3.86 CN3.89 CN3.92 CN3.95 CN3.98 D3.2 FPC1.1 FPC1.4 FPC1.7 FPC1.10 FPC1.13 FPC1.16 FPC1.23 FPC1.26 FPC1.29 FPC1.31 FPC1.32 FPC2.1 FPC2.4 FPC2.7 FPC2.10 FPC2.13 FPC2.16 FPC2.23 FPC2.26 FPC2.29 FPC2.31 FPC2.32 H1.2 H1.4 H1.6 H1.8 HDMI1.2 HDMI1.5 HDMI1.8 HDMI1.11 HDMI1.17 HDMI1.20 HDMI1.21 HDMI1.22 HDMI1.23 LED1.1 LED2.1 NOREF.1 NOREF#2.1 NOREF#3.1 NOREF#4.1 R10.2 R12.1 R20.1 R25.1 R38.1 R40.1 R42.1 R43.1 R48.1 R61.1 R63.1 R65.1 R67.2 R70.2 R72.2 R74.2 R76.2 RJ1.R10 RJ2.R10 TF1.6 TF1.9 TF1.10 TF1.11 TF1.12 TF1.13 TF1.14 U3.1 U3.4 U3.6 U3.13 U3.18 U3.25 U5.2 U5.39 U5.57 U6.2 U7.2 U7.8 U7.11 U8.3 U8.7 U9.2 U9.39 U9.57 U10.2 U11.2 U11.8 U11.11 U12.3 U12.7 USB1.0 USB1.A1 USB1.A12 X1.2 X1.4 X2.2 X2.4

Pads without a net: CN1 1 2 3 5 6 8 9 11 12 23 24 26 27 29 30 32 33 47 48 53 54 56 57 59 60 62 63 65 66 68 69 71 72 76 77 78 79 95 96; CN2 2 3 5 6 8 9 10 12 13 17 18 19 23 24 25 27 28 32 34 35 36 38 40 41 46 47 48 50 52 55 56 63 64 73 75 76 77 78 81 82 83 85 86 87 88 91 92 93 95 96 98 99; CN3 1 2 4 5 7 8 10 11 12 13 14 15 17 18 19 20 21 23 24 25 26 28 29 30 31 33 34 35 36 38 39 41 42 44 45 47 48 49 52 53 54 55 56 58 59 60 61 62 64 65 66 67 69 70 71 72 74 75 76 77 79 87 88 90 91 96 97; FPC1 20 21; FPC2 20 21; HDMI1 14; U3 15 16; U5 4 10 18 21 22 25 33 34 38 40; U6 3; U8 2 5; U9 4 10 18 21 22 25 33 34 38 40; U10 3; U12 2 5; USB1 A8 B8

## Via types
v1: diameter 0.584, hole 0.305, Top Layer to Bottom Layer, 432 vias
v2: diameter 0.61, hole 0.305, Top Layer to Bottom Layer, 27 vias

## Routing (per net, layer and track width the routed paths; a pad name or vN(x,y) marks a point on that pad's centre or on a via; arc(x,y) is an arc through that point)
0V9: length 3.4
  Bottom Layer w0.305: R77.1 5.24,21.69 C107.1
  Bottom Layer w0.508: C107.1 4.94,22.55 5.35,22.96
3V3: length 4.6
  Top Layer w0.508: v1(20.96,48.77) 20.54,49.19 C29.1 18.45,49.19 F7.2
  Bottom Layer w0.508: v1(20.96,48.77) 21.05,48.86 TF1.4
+5V: length 222
  Top Layer w0.305: 69.9,15.08 69.9,14.3 70.99,13.21 73.66,13.21 74.29,12.57 74.29,8.25 v1(74.55,8)
  Top Layer w0.508: F4.1 68.85,14.03 C22.1 65.17,14.03 C20.1 ; v1(16.76,12.7) 16.76,9.02 13.84,6.1 9.98,6.1 D2.2
  Top Layer w1.27: C20.1 62.87,16.34 v1(62.87,17.65)
  Inner1 w0.508: v1(59.56,33.91) 60.58,32.89 60.58,24.89 v1(62.48,22.99)
  Inner2 w0.305: v1(26.8,35.81) 26.8,31.24 v1(27.18,30.86) ; v1(7.49,32.51) 7.49,27.41 v1(6.5,26.42)
  Inner2 w0.508: v1(9.78,21.21) 9.78,22.73 ; 9.78,22.73 v1(12.06,25.02) 11.68,25.4 11.68,26.03 v1(12.06,26.42) ; 9.78,22.73 7.49,25.02 v1(6.5,25.02) 6.89,25.4 6.89,26.03 v1(6.5,26.42) 6.26,26.42 6.26,26.42 5.52,26.42 v1(4.83,25.72)
  Inner2 w1.27: v1(62.87,17.65) 62.87,22.61 v1(62.48,22.99) 60.96,21.46 52.33,21.46 50.67,23.11 46.36,23.11 43.82,20.57 32.05,20.57 ; v1(9.78,21.21) 9.78,16.64 13.72,12.7 v1(16.76,12.7) 24.18,12.7 32.05,20.57 ; 32.05,20.57 v1(29.08,23.54) 28.83,23.8 v1(28.83,29.46) 28.83,38.35 27.18,40 27.18,45.08 25.53,46.74 v1(25.03,46.74) v1(23.88,46.74)
  Bottom Layer w0.305: C78.1 30.88,23.61 U12.6 ; D3.5 74.17,7.62 v1(74.55,8) ; v1(12.06,25.02) 12.03,24.98 U3.11 ; U8.6 32.51,30.1 ; 32.51,30.1 32.51,28.93 32.64,28.8 U8.4 ; 32.51,30.1 31.78,30.1 C46.1 ; v1(59.56,33.91) 60.45,33.02 60.45,30.59 ; U3.3 9.03,29.7 7.49,31.24 v1(7.49,32.51) 5.72,34.29 5.72,37.08 6.32,37.69 R66.1 ; 60.45,30.59 60.45,30.44 60.07,30.06 60.07,29.58 U11.7 ; 60.45,30.59 60.98,30.06 60.98,29.58 U11.9 ; U7.9 27.24,35.37 v1(26.8,35.81) 26.71,35.81 26.29,35.39 26.29,34.91 U7.7 ; 31.62,23.61 31.62,22.48 31.79,22.31 U12.4 ; U3.23 6.57,26.48 v1(6.5,26.42) ; U11.3 60.53,24.94 61.21,24.26 C74.2 61.78,23.69 v1(62.48,22.99) ; C42.2 27.18,30.34 v1(27.18,30.86) 26.79,31.25 26.79,31.89 U7.3 ; U3.8 12,26.48 v1(12.06,26.42) ; v1(6.5,25.02) 6.54,24.98 U3.20
  Bottom Layer w0.508: C114.1 v1(4.83,25.72) ; v1(9.78,21.21) 9.27,20.7 C115.1 ; C46.1 29.39,30.02 v1(28.83,29.46) 28.26,30.04 C42.2 ; C78.1 v1(29.08,23.54)
+5V_HDMI: length 11.9
  Top Layer w0.203: HDMI1.18 20.96,5.87 21.34,5.49 21.34,4.7 20.83,4.19 16.17,4.19 C12.1
  Top Layer w0.305: F6.2 14.77,4.23 C12.1
+5V_IN: length 17.7
  Top Layer w0.508: F4.2 75.69,15.24 76.91,14.02 76.91,11.28 ; USB1.A9 77.67,10.52 76.91,11.28 ; 76.91,11.28 76.91,8.84 76.4,8.33 76.4,7.19 77.09,6.5 C11.1 77.15,5.72 USB1.A4
GND: length 1.8
  Top Layer w0.203: v1(20.57,8.51) 21.14,7.95 21.16,7.95 21.36,7.75 HDMI1.17
  vias: v1(7.24,34.16) v1(8.38,31.75) v1(10.16,31.11) v1(10.29,32.39) v1(15.11,25.91) v1(15.24,22.73) v1(16.89,27.56) v1(17.02,25.65) v1(17.02,24.64) v1(17.02,22.73) v1(17.01,21.18) v1(17.01,19.69) v1(17.27,29.97) v1(18.03,15.75) v1(18.29,29.08) v1(18.8,27.69) v1(18.92,24.64) v1(18.92,22.7) v1(18.92,21.18) v1(18.92,19.69) v1(18.92,14.86) v1(19.69,34.42) v1(19.81,13.97) v1(20.7,33.53) v1(20.7,28.07) v1(20.7,26.81) v1(20.71,24.51) v1(20.68,22.7) v1(20.67,21.18) v1(21.59,32.64) v1(21.72,16.38) v1(22.22,26.8) v1(22.22,19.69) v1(22.6,24.51) v1(22.59,22.7) v1(22.61,15.49) v1(22.99,21.18) v1(23.11,25.78) v1(23.24,18.16) v1(23.24,10.41) v1(23.5,14.61) v1(23.62,30.23) v1(23.68,19.69) v1(23.89,22.7) v1(23.88,9.4) v1(24.16,24.51) v1(24.32,16.51) v1(24.64,29.34) v1(24.76,18.16) v1(25.15,15.62) v1(25.53,43.69) v1(25.53,28.45) v1(25.65,16.51) v1(25.78,24.38) v1(26.13,22.7) v1(26.2,18.16) v1(26.29,21.2) v1(26.29,19.69) v1(27.13,27.52) v1(27.05,24.51) v1(27.43,21.2) v1(27.56,19.69) v1(27.56,18.16) v1(30.35,27.56) v1(30.61,24.51) v1(32.1,27.56) v1(32.94,24.51) v1(33.67,27.56) v1(34.51,24.51) v1(35.25,27.56) v1(36.19,36.45) v1(36.82,27.56) v1(37.65,24.51) v1(38.39,27.56) v1(38.74,37.21) v1(39.27,24.51) v1(39.45,1.6) v1(39.96,27.56) v1(41.53,27.56) v1(42.99,24.51) v1(44.24,24.51) v1(44.32,8.64) v1(44.45,7.49) v1(46.35,34.67) v1(46.61,5.97) v1(48.26,24.51) v1(49.02,35.18) v1(49.28,29.59) v1(49.4,24.51) v1(49.53,46.61) v1(49.53,36.19) v1(49.66,19.56) v1(49.66,12.7) v1(49.78,17.14) v1(50.04,38.61) v1(50.04,14.61) v1(50.24,42.42) v1(50.29,21.84) v1(50.8,39.37) v1(50.93,45.47) v1(51.69,20.45) v1(52.45,24.13) v1(53.09,10.92) v1(53.24,46.48) v1(53.21,8.25) v1(53.5,12.7) v1(53.72,36.45) v1(53.85,22.86) v1(54.1,7.37) v1(54.23,14.35) v1(54.23,9.91) v1(54.63,48.26) v1(54.66,46.48) v1(54.74,38.23) v1(54.86,12.7) v1(54.99,36.45) v1(54.99,26.16) v1(54.99,6.48) v1(55.24,22.61) v1(55.25,8.89) v1(55.6,14.35) v1(55.75,25.4) v1(56.05,48.26) v1(56.08,46.48) v1(56.39,7.75) v1(56.53,22.61) v1(56.64,2.92) v1(56.96,14.35) v1(57.48,48.26) v1(57.51,46.48) v1(57.97,5.46) v1(58.9,48.26) v1(58.93,46.48) v1(59.11,14.99) v1(59.31,7.75) v1(59.34,5.46) v1(59.69,22.61) v1(60.32,48.26) v1(60.48,14.99) v1(60.48,12.57) v1(60.71,5.46) v1(60.83,46.23) v1(60.86,7.97) v1(61.59,45.47) v1(61.7,47.95) v1(61.85,14.99) v1(61.85,12.57) v1(62.36,44.7) v1(62.46,47.19) v1(62.8,8.64) v1(62.8,6.73) v1(62.87,35.81) v1(63.12,43.94) v1(63.22,46.42) v1(63.37,37.59) v1(63.63,35.05) v1(63.88,43.18) v1(63.99,45.66) v1(64.01,39.24) v1(64.13,36.83) v1(64.16,8.64) v1(64.16,6.73) v1(64.32,17.44) v1(64.39,34.29) v1(64.75,44.9) v1(64.8,22.48) v1(65.02,42.04) v1(65.51,44.14) v1(65.53,23.24) v1(65.53,8.64) v1(65.53,6.73) v1(65.69,17.44) v1(65.79,41.28) v1(65.91,33.66) v1(66.27,43.38) v1(66.29,36.96) v1(66.32,21.08) v1(66.55,19.3) v1(66.93,24.77) v1(67.03,42.61) v1(67.03,41.01) v1(67.06,21.84) v1(67.22,33.66) v1(67.31,18.57) v1(67.44,38.35) v1(67.53,15.49) v1(67.69,24.03) v1(68.1,26.29) v1(68.2,28.96) v1(68.2,27.43) v1(68.33,42.61) v1(68.33,41.02) v1(68.33,8.64) v1(68.53,33.66) v1(68.58,37.59) v1(68.58,15.49) v1(68.83,25.53) v1(68.96,28.22) v1(69.07,6.72) v1(69.83,33.66) v1(70.1,8.64) v1(70.74,39.24) v1(70.87,46.99) v1(70.87,44.32) v1(70.92,25.7) v1(70.92,20.61) v1(70.99,28.32) v1(71.14,33.66) v1(71.15,18.42) v1(71.5,14.04) v1(71.68,6.72) v1(71.75,37.85) v1(71.88,19.18) v1(72.45,33.66) v1(73.15,40.51) v1(73.41,34.54) v1(73.41,21.84) v1(74.06,25.04) v1(74.17,46.1) v1(74.17,35.31) v1(74.17,16.51) v1(74.42,48.51) v1(74.42,27.69) v1(74.62,30.12) v1(74.77,7.28) v1(74.93,45.47) v1(75.18,26.95) v1(75.44,47.62) v1(75.39,29.39) v1(76.2,28.58) v1(76.33,46.74) v1(76.38,18.72) v1(76.45,37.59) v1(76.93,43.71) v1(76.96,27.84) v1(77.09,20.83) v1(77.72,9.53) v1(80.65,8.76) v1(81.03,7.75) v1(81.26,25.04) v1(81.38,43.71) v2(10.52,51.16) v2(10.52,46.08) v2(10.52,41) v2(15.6,51.16) v2(15.6,46.08) v2(15.6,41) v2(15.6,35.92) v2(15.6,10.52) v2(15.6,5.44) v2(20.68,41) v2(30.84,30.84) v2(46.08,5.44) v2(51.16,5.44) v2(56.24,51.16) v2(61.32,51.16) v2(61.32,41) v2(61.32,15.6) v2(61.32,10.52) v2(61.32,5.44) v2(66.4,46.08) v2(66.4,41) v2(66.4,10.52) v2(66.4,5.44) v2(71.48,51.16) v2(71.48,5.44) v2(81.64,35.92) v2(81.64,5.44)
CAM_1V2: length 36.2
  Top Layer w0.254: FPC1.28 3.93,10.68 v1(3.81,10.8) 4.19,11.18 FPC1.27
  Top Layer w0.305: FPC2.28 3.87,30.8 v1(3.81,30.86) 4.25,31.3 FPC2.27
  Inner1 w0.508: v1(3.81,30.86) 3.43,30.86 2.79,30.23 2.79,16.89 5.08,14.61 5.08,12.06 v1(3.81,10.8)
  Bottom Layer w0.305: R75.1 5.24,29.71 C106.1
  Bottom Layer w0.508: C112.1 3.17,31.5 v1(3.81,30.86) 4.65,30.02 C106.1 4.94,28.91 5.35,28.5 ; v1(3.81,10.8) 3.56,11.05 C113.1
CAM_1V8: length 44.6
  Top Layer w0.254: FPC2.30 5.02,29.46 v1(3.81,29.46) ; v1(4.32,8.76) 5.23,9.68 FPC1.30
  Inner1 w0.508: v1(4.32,8.76) 4.32,9.65 6.1,11.43 6.1,15.37 3.81,17.65 v1(3.81,29.46) 7.24,29.46 7.87,28.83 13.97,28.83 v1(14.73,29.59)
  Bottom Layer w0.305: C105.1 13.18,29.84 R73.1
  Bottom Layer w0.508: C109.1 4.06,9.02 v1(4.32,8.76) ; v1(3.81,29.46) C108.1 ; L18.1 13.65,28.5 v1(14.73,29.59) 14.18,30.14 C105.1
CAM_2V8: length 56.9
  Top Layer w0.254: FPC1.24 4.17,12.68 v1(3.81,12.32) 3.95,12.18 FPC1.25 ; FPC2.24 3.84,32.8 v1(3.81,32.77) 4.28,32.3 FPC2.25
  Inner1 w0.508: v1(3.81,12.32) 1.65,14.48 1.65,30.61 v1(3.81,32.77)
  Bottom Layer w0.305: C104.1 13.05,21.69 R71.1
  Bottom Layer w0.508: v1(3.81,32.77) C110.1 2.7,34.91 R79.2 ; 2.79,14.81 2.7,14.72 C111.1 v1(3.81,12.32) 5.21,12.32 8.13,15.24 11.56,15.24 14.86,18.54 14.86,20.7 14.3,21.26 C104.1 13.48,22.55 13.07,22.96
CAM_PWR_EN: length 25.3
  Top Layer w0.203: v1(5.97,25.72) 5.72,25.98 5.72,27.31 v1(9.27,30.86) 12.83,27.31 12.83,25.95 v1(12.6,25.72)
  Bottom Layer w0.203: R66.2 R67.1 6.87,36.2 C10.1 7.97,36.09 8.12,36.09 8.27,35.94 8.27,35.78 9.27,34.78 v1(9.27,30.86)
  Bottom Layer w0.305: 7.38,25.72 U3.21 ; 7.38,25.72 U3.22 ; 7.38,25.72 v1(5.97,25.72) ; 11.18,25.72 U3.10 ; 11.18,25.72 v1(12.6,25.72) ; 11.18,25.72 U3.9
CM4_1V8: length 0.4
  Top Layer w0.203: CN2.45 CN2.44
CM4_3V3: length 18.5
  Top Layer w0.203: CN2.42 24.74,41.8 24.89,41.66 25.78,41.66 25.94,41.82 CN2.39
  Top Layer w0.254: CN2.42 CN2.43 24.34,42.97 24.13,43.18 20.7,43.18 15.62,48.26 F7.1
  Top Layer w0.508: C28.1 C27.1 13.5,48.64 F7.1
CSI0_CKN: length 35.5
  Top Layer w0.158: v1(25.02,20.79) 24.81,20.58 6.36,20.58 6.26,20.68 FPC1.8 ; v1(31.65,17.42) 31.65,17.12 35.9,12.87 35.9,12.08 35.94,12.03 CN1.87
  Bottom Layer w0.158: v1(31.65,17.42) 31.34,17.42 28.19,20.58 25.23,20.58 v1(25.02,20.79)
CSI0_CKP: length 35.5
  Top Layer w0.158: CN1.86 35.54,12.03 35.59,12.08 35.59,12.74 31.43,16.9 v1(31.13,16.9) ; v1(25.02,20.06) 24.81,20.27 8.15,20.27 arc(8.04,20.23) 8,20.12 8,20.04 arc(7.85,19.89) 7.69,20.04 7.69,20.12 arc(7.65,20.23) 7.54,20.27 6.36,20.27 6.26,20.18 FPC1.9
  Bottom Layer w0.158: v1(25.02,20.06) 25.23,20.27 28.06,20.27 31.13,17.2 v1(31.13,16.9)
CSI0_CLK: length 51.8
  Top Layer w0.203: FPC1.17 v1(13.84,16.18) ; CN2.80 33.14,44.57 v1(32.89,44.32)
  Inner1 w0.203: v1(32.89,44.32) 22.73,44.32 16.76,38.35 16.76,31.11 16.13,30.48 16.13,18.52 16.16,18.49 v1(13.84,16.18)
CSI0_D0N: length 38.9
  Top Layer w0.158: CN1.93 38.34,12.03 38.3,12.08 38.3,14.08 30.3,22.08 6.36,22.08 6.26,22.18 FPC1.5
CSI0_D0P: length 38.9
  Top Layer w0.158: FPC1.6 6.26,21.68 6.36,21.77 8.51,21.77 arc(8.61,21.73) 8.66,21.62 8.66,21.54 arc(8.81,21.39) 8.96,21.54 8.96,21.62 arc(9.01,21.73) 9.11,21.77 30.17,21.77 37.99,13.95 37.99,12.08 37.94,12.03 CN1.92
CSI0_D1N: length 36
  Top Layer w0.158: FPC1.11 6.26,19.18 6.36,19.08 31.34,19.08 37.1,13.32 37.1,12.08 37.14,12.03 CN1.90
CSI0_D1P: length 36
  Top Layer w0.158: FPC1.12 6.26,18.68 6.36,18.77 8.4,18.77 arc(8.51,18.73) 8.55,18.62 8.55,18.54 arc(8.7,18.39) 8.86,18.54 8.86,18.62 arc(8.9,18.73) 9.01,18.77 31.21,18.77 36.79,13.19 36.79,12.08 36.74,12.03 CN1.89
CSI0_D2N: length 37.2
  Top Layer w0.158: v1(33.1,14.49) 33.1,14.18 34.7,12.59 34.7,12.08 34.74,12.03 CN1.84 ; v1(25.02,23.79) 24.81,23.58 6.36,23.58 6.26,23.68 FPC1.2
  Bottom Layer w0.158: v1(25.02,23.79) 25.23,23.58 26.9,23.58 32.57,17.91 32.57,14.83 32.92,14.49 v1(33.1,14.49)
CSI0_D2P: length 37.2
  Top Layer w0.158: v1(25.02,23.06) 24.81,23.27 8.29,23.27 arc(8.18,23.23) 8.14,23.12 8.14,23.06 arc(7.98,22.91) 7.83,23.06 7.83,23.12 arc(7.79,23.23) 7.68,23.27 6.36,23.27 6.26,23.18 FPC1.3 ; v1(32.58,13.97) 32.88,13.97 34.39,12.46 34.39,12.08 34.34,12.03 CN1.83
  Bottom Layer w0.158: v1(32.58,13.97) 32.58,13.97 32.58,14.38 32.26,14.71 32.26,17.78 26.77,23.27 25.23,23.27 v1(25.02,23.06)
CSI0_D3N: length 31.2
  Top Layer w0.158: FPC1.14 6.26,17.68 6.36,17.58 28.28,17.58 32.06,13.8 32.06,13.75 32.37,13.44 32.42,13.44 33.5,12.37 33.5,12.08 33.54,12.03 CN1.81
CSI0_D3P: length 31.2
  Top Layer w0.158: CN1.80 33.14,12.03 33.19,12.08 33.19,12.24 32.29,13.13 32.24,13.13 31.75,13.62 31.75,13.68 28.16,17.27 8.31,17.27 arc(8.2,17.23) 8.16,17.12 8.16,17.04 arc(8,16.89) 7.85,17.04 7.85,17.12 arc(7.81,17.23) 7.7,17.27 6.36,17.27 6.26,17.18 FPC1.15
CSI0_NRST: length 4.1
  Top Layer w0.203: v1(3.81,13.97) 4.1,13.68 FPC1.22
  Bottom Layer w0.203: v1(3.81,13.97) 3.81,15.11 3.25,15.67 R78.1
CSI1_CKN: length 49.3
  Top Layer w0.158: 33.54,8.45 33.54,8.95 33.21,9.28 33.21,9.28 32.55,9.94 25.52,9.94 25.3,10.17 v1(25.3,10.31) ; v1(15.91,31.91) 15.6,31.91 6.81,40.7 6.36,40.7 6.26,40.8 FPC2.8
  Bottom Layer w0.158: v1(25.3,10.31) 25,10.31 16.26,19.05 16.26,31.24 15.91,31.59 15.91,31.91 v1(15.91,31.91)
CSI1_CKP: length 49.3
  Top Layer w0.158: v1(24.78,9.79) 25.08,9.79 25.24,9.63 32.43,9.63 33.14,8.91 33.14,8.45 ; v1(15.38,31.39) 15.38,31.69 7.89,39.18 arc(7.79,39.22) 7.68,39.18 7.64,39.14 arc(7.42,39.14) 7.42,39.35 7.46,39.39 arc(7.51,39.5) 7.46,39.61 6.68,40.39 6.36,40.39 6.26,40.3 FPC2.9
  Bottom Layer w0.158: v1(15.38,31.39) 15.67,31.39 15.95,31.11 15.95,18.92 24.78,10.09 v1(24.78,9.79)
CSI1_CLK: length 40.6
  Top Layer w0.203: v1(3.17,37.34) 4.22,36.3 FPC2.17 ; v1(29.59,43.69) 29.94,43.33 CN2.29
  Bottom Layer w0.203: v1(29.59,43.69) 29.08,43.69 28.19,42.8 22.1,42.8 17.91,46.99 7.24,46.99 5.59,45.34 4.19,45.34 3.17,44.32 v1(3.17,37.34)
CSI1_D0N: length 51.1
  Top Layer w0.158: FPC2.5 6.26,42.3 6.36,42.2 6.82,42.2 19.94,29.08 19.94,25.78 v1(20.15,25.57) ; v1(35.5,10.27) 35.5,9.97 35.87,9.6 35.87,8.51
  Bottom Layer w0.158: v1(35.5,10.27) 35.19,10.27 33.91,11.56 27.94,11.56 19.94,19.56 19.94,25.35 v1(20.15,25.57)
CSI1_D0P: length 51.1
  Top Layer w0.158: v1(34.96,9.76) 35.26,9.76 35.5,9.52 35.5,8.51 ; v1(19.42,25.57) 19.63,25.78 19.63,28.95 7.88,40.7 arc(7.77,40.75) 7.66,40.7 7.59,40.63 arc(7.38,40.63) 7.38,40.85 7.45,40.92 arc(7.49,41.03) 7.45,41.14 6.69,41.89 6.36,41.89 6.26,41.8 FPC2.6
  Bottom Layer w0.158: v1(19.42,25.57) 19.63,25.35 19.63,19.43 27.81,11.25 33.78,11.25 34.96,10.07 v1(34.96,9.76)
CSI1_D1N: length 48.1
  Top Layer w0.158: 34.74,8.45 34.74,8.95 34.7,9 34.7,9.29 33.95,10.04 v1(33.95,10.33) ; FPC2.11 6.26,39.3 6.36,39.2 6.83,39.2 18.03,28 18.03,26.88 v1(18.25,26.67)
  Bottom Layer w0.158: v1(18.25,26.67) 18.03,26.46 18.03,19.18 26.68,10.53 33.44,10.53 33.64,10.33 v1(33.95,10.33)
CSI1_D1P: length 48.2
  Top Layer w0.158: v1(33.43,9.81) 33.74,9.81 34.39,9.16 34.39,9 34.34,8.95 34.34,8.45 ; v1(17.51,26.67) 17.72,26.88 17.72,27.87 8.06,37.53 arc(7.95,37.58) 7.84,37.53 7.78,37.47 arc(7.56,37.47) 7.56,37.69 7.63,37.75 arc(7.67,37.86) 7.63,37.97 6.7,38.89 6.36,38.89 6.26,38.8 FPC2.12
  Bottom Layer w0.158: v1(33.43,9.81) 33.43,10.11 33.31,10.22 26.55,10.22 17.72,19.05 17.72,26.46 v1(17.51,26.67)
CSI1_D2N: length 66.9
  Top Layer w0.158: CN3.81 60.21,24.78 60.17,24.74 59.88,24.74 59.87,24.72 59.85,24.72 v1(59.64,24.93) ; FPC2.2 4.45,43.8 4.35,43.7 3.95,43.7 v1(3.73,43.91)
  Bottom Layer w0.158: v1(3.73,43.91) 3.95,43.7 5.32,43.7 14.66,34.37 18.54,34.37 26.11,26.8 53.29,26.8 55.37,24.72 59.43,24.72 v1(59.64,24.93)
CSI1_D2P: length 66.9
  Top Layer w0.158: v1(3.73,43.18) 3.95,43.39 4.35,43.39 4.45,43.3 FPC2.3 ; CN3.82 60.21,24.38 60.17,24.43 60.16,24.43 60.14,24.41 59.85,24.41 v1(59.64,24.2)
  Bottom Layer w0.158: v1(59.64,24.2) 59.43,24.41 55.24,24.41 53.16,26.49 25.98,26.49 18.41,34.06 14.53,34.06 5.19,43.39 3.95,43.39 v1(3.73,43.18)
CSI1_D3N: length 61.6
  Top Layer w0.158: FPC2.14 6.26,37.8 6.36,37.7 6.75,37.7 10.42,34.03 v1(10.72,34.03) ; CN3.84 60.21,23.58 60.17,23.54 60.01,23.54 60,23.55 59.04,23.55 v1(58.83,23.76)
  Bottom Layer w0.158: v1(58.83,23.76) 58.61,23.55 54.69,23.55 52.71,25.53 25.27,25.53 17.76,33.05 11.4,33.05 10.72,33.73 v1(10.72,34.03)
CSI1_D3P: length 61.6
  Top Layer w0.158: FPC2.15 6.26,37.3 6.36,37.39 6.62,37.39 10.2,33.82 v1(10.2,33.51) ; v1(58.83,23.02) 59.04,23.24 59.88,23.24 59.88,23.23 60.17,23.23 60.21,23.18 CN3.85
  Bottom Layer w0.158: v1(58.83,23.02) 58.61,23.24 54.56,23.24 52.58,25.22 25.15,25.22 17.63,32.74 11.28,32.74 10.5,33.51 v1(10.2,33.51)
CSI1_NRST: length 4.2
  Top Layer w0.203: v1(3.81,34.04) 4.05,33.8 FPC2.22
  Bottom Layer w0.203: v1(3.81,34.04) 3.81,35.31 3.25,35.87 R79.1
ETH0_1V2: length 105.3
  Top Layer w0.305: v1(24.13,31.37) 24.13,34.04 v1(23.37,34.8)
  Inner1 w0.508: v1(48.51,42.16) 48.13,41.78 47.24,41.78 42.93,46.1 v1(42.93,47.12) v1(40.23,47.12) 38.74,45.63 38.74,44.45 37.85,43.56 v1(37.47,43.56) 37.47,41.91 v1(37.85,41.53) 41.28,38.1 v1(41.28,36.83) 41.91,36.19 v1(42.93,36.19) 46.23,32.89 v1(49.91,32.89) ; v1(30.48,41.28) 23.75,41.28 v1(20.96,38.48)
  Inner2 w0.508: v1(37.85,41.53) 36.83,42.55 32.64,42.55 31.37,41.28 v1(30.48,41.28) 30.48,44.07 31.12,44.7 31.12,50.55 v1(30.86,50.8)
  Bottom Layer w0.203: C59.2 v1(41.28,36.83) 41.23,36.88 U5.11 ; C55.2 37.34,43.43 v1(37.47,43.56) 38.12,42.9 U5.23 ; U5.36 43.23,46.82 v1(42.93,47.12) 43.05,47.24 C57.2 ; v1(49.91,32.89) 49.91,32.79 C60.2 ; U5.20 37.97,41.4 v1(37.85,41.53) 37.85,41.78 37.59,42.04 C62.2 ; U5.49 47.51,42.4 47.75,42.16 v1(48.51,42.16) 48.77,41.91 C61.2 ; C41.1 31.05,49.68 U6.4 ; U5.8 42.73,37.65 42.42,37.34 42.42,36.7 v1(42.93,36.19) 43.31,35.81 C58.2 ; C56.2 40.23,47.51 v1(40.23,47.12) U5.30
  Bottom Layer w0.305: v1(24.13,31.37) 24.76,30.73 25.91,30.73 26.24,31.07 U7.4 ; v1(30.48,41.28) 30.48,40.07 L7.1 ; v1(23.37,34.8) 23.19,34.98 R39.2
  Bottom Layer w0.508: C41.1 30.95,50.71 v1(30.86,50.8) ; C45.1 23.75,36.44 L4.2 ; 22.3,36.38 R39.2 ; L8.1 52.13,32.89 v1(49.91,32.89) 49.47,32.45 L9.1 ; v1(20.96,38.48) 22.35,37.08 22.35,36.7
ETH0_1V2A: length 22.5
  Inner1 w0.508: v1(48.01,37.72) 48.77,38.48 v1(48.77,39.75) 49.4,40.39 49.4,42.49 49.03,42.86 48.22,42.86 48.16,42.8 v1(48.01,42.8) v1(48.01,44.4)
  Bottom Layer w0.203: C64.2 v1(48.77,39.75) 48.51,39.75 47.86,40.4 U5.53 ; U5.56 48.01,37.78 v1(48.01,37.72) 48.51,37.21 C65.2 ; U5.48 47.9,42.9 v1(48.01,42.8) 48.13,42.93 C63.2 ; C66.2 48.96,44.4 v1(48.01,44.4) U5.45
  Bottom Layer w0.508: L9.2 47.88,37.59 v1(48.01,37.72)
ETH0_1V2PLL: length 12.9
  Inner1 w0.508: v1(50.55,41.53) 51.69,40.39 51.69,38.99 51.31,38.61 v1(51.31,35.18)
  Bottom Layer w0.203: C54.2 50.67,41.4 v1(50.55,41.53) 50.42,41.4 48.77,41.4 48.55,41.62 48.29,41.62 48.25,41.66 47.62,41.66 47.38,41.9 U5.50
  Bottom Layer w0.508: v1(51.31,35.18) 51.31,35.12 L8.2
ETH0_1V2USBPLL: length 8
  Bottom Layer w0.203: U5.17 37.17,39.9
  Bottom Layer w0.305: 37.08,39.77 37.17,39.87 37.17,40.17 36.96,40.39 35.94,40.39 34.42,38.86 33.09,38.86 L7.2
ETH0_2V5: length 90.2
  Top Layer w0.203: v1(45.09,36.83) 43.31,36.83 v1(43.05,37.08)
  Inner1 w0.203: v1(38.48,51.18) 39.5,50.17 39.5,48.01
  Inner1 w0.508: 36.83,32.89 v1(38.74,34.8) 37.59,35.94 37.59,37.49 37.53,37.56 37.53,38.14 37.59,38.2 v1(37.59,40.64) 36.47,41.76 36.47,44.09 36.83,44.45 v1(37.47,44.45) 37.47,45.97 39.5,48.01 43.18,48.01 v1(44.07,47.12) v1(45.97,49.02) ; 36.83,32.89 34.67,32.89 31.24,36.32 v1(31.24,38.1) ; 36.83,32.89 39.24,30.48 51.82,30.48 v1(53.59,32.26)
  Inner2 w0.508: v1(38.74,34.8) 39.5,35.56 41.15,35.56 42.67,37.08 v1(43.05,37.08)
  Bottom Layer w0.203: R24.1 39.12,35.18 v1(38.74,34.8) ; C51.2 v1(44.07,47.12) 43.73,46.77 U5.37 ; v1(45.97,49.02) 46.6,49.02 R21.2 ; U5.7 43.23,37.26 v1(43.05,37.08) ; v1(45.09,36.83) 45.47,36.45 C49.2 45.95,35.83 46.22,35.57 R22.1 ; U5.24 38.51,43.4 v1(37.47,44.45) 37.08,44.83 C50.2 ; R37.2 37.83,51.83 v1(38.48,51.18) ; C52.2 37.21,41.02 v1(37.59,40.64) 37.86,40.9 U5.19 ; C43.1 31.43,35.09 R41.2
  Bottom Layer w0.508: R41.2 31.25,35.04 C44.1 ; 54.54,33.4 53.59,32.45 v1(53.59,32.26) ; C44.1 31.24,36.71 v1(31.24,38.1) ; C44.1 29.73,36.7 L5.2
ETH0_2V5A_PHY: length 93.3
  Top Layer w0.203: RJ1.L1 RJ1.L3
  Inner1 w0.508: v1(65.66,40.39) 65.41,40.13 60.07,40.13 v1(55.25,35.31) 53.47,35.31 v1(52.71,36.07) 52.32,36.45 v1(52.32,38.24) 52.96,38.87 v1(52.96,41.15) 52.96,44.83 v1(52.58,45.21) 50.67,47.12 v1(50.67,48.51)
  Bottom Layer w0.203: v1(65.66,40.39) 66.29,39.75 R36.2 ; R30.2 51.55,42.68 52.96,41.28 v1(52.96,41.15) 52.96,40.75 R29.2 ; R32.2 52.58,45.86 v1(52.58,45.21) 52.06,44.69 R31.2 ; R26.2 51.19,36.07 v1(52.71,36.07) ; R33.2 51.93,48.51 v1(50.67,48.51) 55.37,53.21 79.01,53.21 RJ1.L1 ; R28.2 v1(52.32,38.24) 52.27,38.29 R27.2
  Bottom Layer w0.508: L3.2 56.73,34.19 C30.2 C31.2 56.18,36.24 v1(55.25,35.31)
ETH0_3V3: length 27.5
  Inner1 w0.508: v1(35.31,34.04) 35.31,49.53 v1(36.7,50.93)
  Bottom Layer w0.305: U8.1 36.48,30.1 C47.1
  Bottom Layer w0.508: U6.6 34.54,49.58 C40.1 36.7,50.26 v1(36.7,50.93) ; C47.1 36.96,30.57 L6.1 36.01,33.34 v1(35.31,34.04)
ETH0_3V3A: length 5.3
  Bottom Layer w0.203: U5.15 38.54,38.9 C48.2
  Bottom Layer w0.305: L6.2 37.23,35.01 C48.2
ETH0_LED0: length 34.2
  Top Layer w0.203: R35.1 64.01,35.81 62.61,37.21 54.48,37.21 52.2,39.5 52.2,42.16 46.61,47.75 41.87,47.75 v1(40.73,48.89)
  Bottom Layer w0.203: U5.31 40.73,46.84 40.77,46.89 40.77,47.34 40.73,47.39 v1(40.73,48.89)
ETH0_LED1: length 30.7
  Top Layer w0.203: v1(41.91,48.89) 42.54,48.26 46.86,48.26 56.39,38.73 63.12,38.73 63.53,38.33 65.13,38.33
  Bottom Layer w0.203: v1(41.91,48.89) 41.23,48.21 U5.32
ETH0_NRST: length 15.2
  Inner2 w0.203: v1(46.48,46.74) 45.97,46.74 44.83,47.88 37.08,47.88 v1(36.19,46.99)
  Bottom Layer w0.203: U6.1 34.84,46.99 v1(36.19,46.99) ; R21.1 47.37,47.62 v1(46.48,46.74) 46.23,46.48 U5.42
ETH0_TR0_N: length 31.3
  Bottom Layer w0.158: RJ1.R2 72.57,39.33 72.57,39.75 72.28,40.04 71.7,40.04 71.63,40.11 71.63,41.07 70.74,41.97 66.68,41.97 61.12,47.53 52.44,47.53 R33.1 51.7,47.53 51.42,47.53 49.77,45.88 48.7,45.88 48.13,45.31 47.47,45.31 47.37,45.4 U5.43
ETH0_TR0_P: length 31.3
  Bottom Layer w0.158: RJ1.R3 70.03,40.6 70.44,40.6 71.02,40.03 71.09,40.03 71.32,40.26 71.32,40.94 70.61,41.66 66.55,41.66 65.25,42.95 arc(65.14,43) 65.03,42.95 64.97,42.89 arc(64.75,42.89) 64.75,43.11 64.82,43.17 arc(64.86,43.28) 64.82,43.39 60.99,47.22 52.44,47.22 R32.1 51.7,47.22 51.55,47.22 49.9,45.57 48.83,45.57 48.26,45 47.47,45 47.37,44.9 U5.44
ETH0_TR1_N: length 39.9
  Bottom Layer w0.158: RJ1.R4 72.57,41.87 72.57,42.29 72.36,42.5 72.2,42.5 72.19,42.49 71.71,42.49 71.6,42.6 71.6,42.65 71.83,42.88 73.25,42.88 73.76,42.37 73.76,38.73 71.91,36.89 67.74,36.89 64.29,40.34 63.27,40.34 arc(63.16,40.39) 63.12,40.49 63.12,40.61 arc(62.96,40.77) 62.81,40.61 62.81,40.49 arc(62.66,40.34) 62.51,40.49 62.51,40.61 arc(62.35,40.77) 62.2,40.61 62.2,40.49 arc(62.16,40.38) 62.05,40.34 55.08,40.34 51.58,43.84 51.29,43.84 R31.1 50.56,43.84 50.28,43.84 50.24,43.81 47.47,43.81 47.37,43.9 U5.46
ETH0_TR1_P: length 39.9
  Bottom Layer w0.158: U5.47 47.37,43.4 47.47,43.5 50.37,43.5 50.4,43.53 50.56,43.53 R30.1 51.29,43.53 51.45,43.53 54.95,40.03 64.16,40.03 67.62,36.58 72.04,36.58 74.07,38.61 74.07,42.5 73.38,43.19 71.7,43.19 71.38,42.87 70.72,42.87 70.44,43.14 70.03,43.14 RJ1.R5
ETH0_TR2_N: length 43.8
  Bottom Layer w0.158: U5.51 47.37,41.4 47.47,41.31 48.21,41.31 48.63,40.88 50.71,40.88 52.2,39.4 53.1,39.4 R29.1 53.83,39.4 55.3,39.4 55.8,38.89 61.56,38.89 arc(61.67,38.94) 61.71,39.05 61.71,39.09 arc(61.87,39.24) 62.02,39.09 62.02,39.05 arc(62.17,38.89) 62.32,39.05 62.32,39.09 arc(62.48,39.24) 62.63,39.09 62.63,39.05 arc(62.67,38.94) 62.78,38.89 63.35,38.89 66.45,35.79 71.96,35.79 74.8,38.64 74.8,43.71 73.1,45.41 71.91,45.41 71.47,44.97 71.47,44.92 71.58,44.81 71.97,44.81 72.2,45.04 72.36,45.04 72.57,44.83 72.57,44.41 RJ1.R6
ETH0_TR2_P: length 43.8
  Bottom Layer w0.158: RJ1.R7 70.03,45.68 70.44,45.68 70.94,45.19 71.25,45.19 71.78,45.72 73.23,45.72 75.11,43.84 75.11,38.51 72.09,35.48 66.32,35.48 63.22,38.58 55.67,38.58 55.17,39.09 53.83,39.09 R28.1 53.1,39.09 52.07,39.09 50.59,40.57 48.5,40.57 48.08,41 47.47,41 47.37,40.9 U5.52
ETH0_TR3_N: length 48.4
  Bottom Layer w0.158: RJ1.R8 72.57,46.95 72.57,47.26 72.46,47.37 71.99,47.37 71.66,47.7 71.66,47.86 71.78,47.98 73.53,47.98 75.86,45.65 75.86,38.51 72.01,34.65 65.43,34.65 62.61,37.47 61.49,37.47 arc(61.38,37.51) 61.34,37.62 61.34,37.77 arc(61.19,37.92) 61.03,37.77 61.03,37.62 arc(60.88,37.47) 60.73,37.62 60.73,37.77 arc(60.58,37.92) 60.42,37.77 60.42,37.62 arc(60.38,37.51) 60.27,37.47 51.25,37.47 R27.1 50.57,37.47 50.1,37.47 47.75,39.81 47.47,39.81 47.37,39.9 U5.54
ETH0_TR3_P: length 48.3
  Bottom Layer w0.158: U5.55 47.37,39.4 47.47,39.5 47.63,39.5 49.97,37.16 50.59,37.16 R26.1 51.27,37.16 62.48,37.16 65.3,34.34 72.14,34.34 76.17,38.38 76.17,45.78 73.66,48.29 71.65,48.29 71.36,48 70.67,48 70.44,48.22 70.03,48.22 69.94,48.13
ETH0_USB_M: length 36.6
  Top Layer w0.158: v1(40.78,34.38) 40.57,34.16 40.57,33.09 arc(40.61,32.98) 40.72,32.94 40.79,32.94 arc(40.94,32.79) 40.79,32.63 40.72,32.63 arc(40.61,32.59) 40.57,32.48 40.57,30.48 54.48,16.57 57.87,16.57 59,17.7 59,19.05 59.88,19.94 60.17,19.94 60.21,19.98 CN3.93
  Bottom Layer w0.158: v1(40.78,34.38) 40.57,34.59 40.57,34.75 40.63,34.81 40.63,37.66 40.73,37.76 U5.12
ETH0_USB_P: length 36.6
  Top Layer w0.158: CN3.94 60.21,19.58 60.17,19.63 60.01,19.63 59.31,18.92 59.31,17.57 57.99,16.26 54.36,16.26 40.26,30.35 40.26,34.16 v1(40.05,34.38)
  Bottom Layer w0.158: v1(40.05,34.38) 40.26,34.59 40.26,34.88 40.32,34.94 40.32,37.66 40.23,37.76 U5.13
ETH1_1V2: length 107.3
  Inner1 w0.305: v1(54.74,29.46) 54.99,29.46 v1(58.8,25.65)
  Inner1 w0.508: 45.4,18.86 47.12,17.14 v1(47.24,17.14) ; 45.4,18.86 54.74,28.19 v1(54.74,29.46) ; 45.4,18.86 v1(42.16,22.1) v1(39.24,22.1) 38.48,21.34 38.48,18.16 38.1,17.78 v1(36.7,17.78) 36.7,16.89 v1(36.96,16.64) 40.51,13.08 v1(40.51,10.54) 41.66,10.54 v1(42.29,11.18) 43.31,11.18 47.12,7.37 v1(50.55,7.37)
  Inner2 w0.305: v1(39.12,5.97) 40.51,7.37 v1(40.51,10.54)
  Inner2 w0.508: v1(30.1,16.89) 31.37,18.16 36.32,18.16 v1(36.7,17.78)
  Bottom Layer w0.203: C93.2 36.19,18.29 v1(36.7,17.78) 36.74,17.81 U9.23 ; 42.16,23.01 v1(42.16,22.1) 42.41,21.85 U9.36 ; C94.2 38.99,22.35 v1(39.24,22.1) 39.41,21.93 U9.30 ; C73.1 37.21,4.68 U10.4 ; C89.2 v1(40.51,10.54) 40.41,10.64 U9.11 ; C92.2 36.45,17.14 v1(36.96,16.64) 37.28,16.31 U9.20 ; U9.49 47.08,17.31 v1(47.24,17.14) 47.62,16.76 C91.2 ; U9.8 41.91,12.58 41.66,12.32 41.66,11.81 v1(42.29,11.18) 42.54,10.92 C90.2 ; C88.2 50.55,7.3 v1(50.55,7.37)
  Bottom Layer w0.305: v1(39.12,5.97) 37.92,4.77 C73.1 ; U11.4 60.03,25.99 59.69,25.65 v1(58.8,25.65)
  Bottom Layer w0.508: L10.2 56.16,31.24 56.02,31.11 56.08,31.04 R62.2 54.92,29.64 v1(54.74,29.46) ; L16.1 49.09,8.83 v1(50.55,7.37) 51.88,7.37 L15.1 ; L14.1 29.91,16.7 v1(30.1,16.89)
ETH1_1V2A: length 21.5
  Inner1 w0.508: v1(47.37,19.31) 47.88,18.8 v1(47.88,17.81) 48.13,17.56 48.13,15.37 v1(47.62,14.86) 46.86,14.1 v1(46.86,12.32)
  Bottom Layer w0.203: U9.53 46.79,15.31 47.24,14.86 v1(47.62,14.86) 47.71,14.78 C97.2 ; C98.2 47.67,19.61 v1(47.37,19.31) U9.45 ; U9.56 46.86,13.02 v1(46.86,12.32) 46.88,12.3 47.48,12.3 47.62,12.45 47.62,12.51 C96.2 ; U9.48 v1(47.88,17.81) 47.91,17.78 C99.2
  Bottom Layer w0.508: 46.88,12.3 46.88,11.35 48.01,10.22
ETH1_1V2PLL: length 14.5
  Inner1 w0.508: v1(49.02,16.38) 49.66,15.75 50.42,15.75 50.93,15.24 50.93,12.57 50.29,11.94 v1(50.29,9.4)
  Bottom Layer w0.203: U9.50 46.55,16.81 46.86,16.5 47.24,16.5 47.62,16.13 48.77,16.13 v1(49.02,16.38) C87.2
  Bottom Layer w0.508: v1(50.29,9.4) 50.99,8.7 51.94,8.7
ETH1_1V2USBPLL: length 12.1
  Inner2 w0.508: v1(36.32,14.86) 34.8,14.86 34.16,15.49 32.51,15.49 31.88,14.86 v1(28.96,14.86)
  Bottom Layer w0.203: U9.17 38.21,14.86 v1(36.32,14.86) 35.83,14.86 C86.2
  Bottom Layer w0.508: L14.2 28.51,15.3 v1(28.96,14.86)
ETH1_2V5: length 105.8
  Top Layer w0.203: v1(44.32,11.81) 44.07,12.06 v1(42.29,12.06)
  Inner1 w0.508: v1(33.02,3.56) 34.16,4.7 34.16,6.22 v1(37.59,9.65) ; v1(37.59,9.65) 44.86,2.39 v1(52.07,2.39) ; v1(37.59,9.65) 36.7,10.54 36.7,11.94 35.43,13.21 v1(35.43,15.75) 35.43,17.91 36.19,18.67 v1(36.96,18.67) 36.96,21.34 38.74,23.11 42.29,23.11 v1(43.31,22.1) v1(45.21,24) 50.67,29.46 52.07,29.46 57.53,34.92 62.23,34.92 v1(64.52,32.64)
  Inner2 w0.508: v1(37.59,9.65) 40,12.06 v1(42.29,12.06)
  Bottom Layer w0.203: R44.2 45.43,24 v1(45.21,24) ; C82.2 36.32,19.3 v1(36.96,18.67) 37.31,18.31 U9.24 ; U9.7 42.41,12.19 v1(42.29,12.06) ; C75.1 65.21,29.75 R64.2 ; R47.1 37.97,10.03 v1(37.59,9.65) ; U9.19 35.5,15.81 v1(35.43,15.75) 35.13,16.05 C84.2 ; U9.37 42.91,21.7 v1(43.31,22.1) 43.31,22.88 43.18,23.01 ; v1(33.02,3.56) 33.19,3.39 R60.2 ; R45.1 45.54,10.47 45.09,10.92 44.7,10.92 44.7,11.43 v1(44.32,11.81)
  Bottom Layer w0.508: 65.03,31.37 63.51,31.37 L11.2 ; 65.03,31.37 65.1,31.3 R64.2 ; 65.03,31.37 65.03,32.12 v1(64.52,32.64) ; L12.1 52.95,2.39 v1(52.07,2.39)
ETH1_2V5A_PHY: length 84.5
  Top Layer w0.203: RJ2.L1 RJ2.L3
  Inner1 w0.203: 61,18.54 63.04,16.51 70.49,16.51 72.01,14.99 77.6,14.99 82.21,19.6 RJ2.L3
  Inner1 w0.508: v1(52.58,23.11) v1(52.58,19.55) ; v1(52.58,19.55) 53.58,18.54 63.75,18.54 v1(65.28,20.07) ; v1(52.58,19.55) 52.58,17.78 v1(52.2,17.4) v1(52.2,15.49) 52.2,12.19 v1(51.44,11.43) 51.44,8.64 53.59,6.48 v1(53.59,5.84)
  Bottom Layer w0.203: v1(51.44,11.43) 51.44,12.08 R49.2 ; v1(52.58,23.11) 52.58,22.59 R56.2 ; R59.2 v1(65.28,20.07) ; R52.2 53.07,17.4 v1(52.2,17.4) 52.06,17.54 R53.2 ; R55.2 52.83,19.8 v1(52.58,19.55) R54.2 ; R50.2 51.34,14.64 v1(52.2,15.49) 52.31,15.38 R51.2
  Bottom Layer w0.508: 54.68,2.71 54.96,3 C69.2 54.97,4.14 C80.2 54.03,5.4 v1(53.59,5.84)
